# Altium project Throttle By Wire.PrjPcb
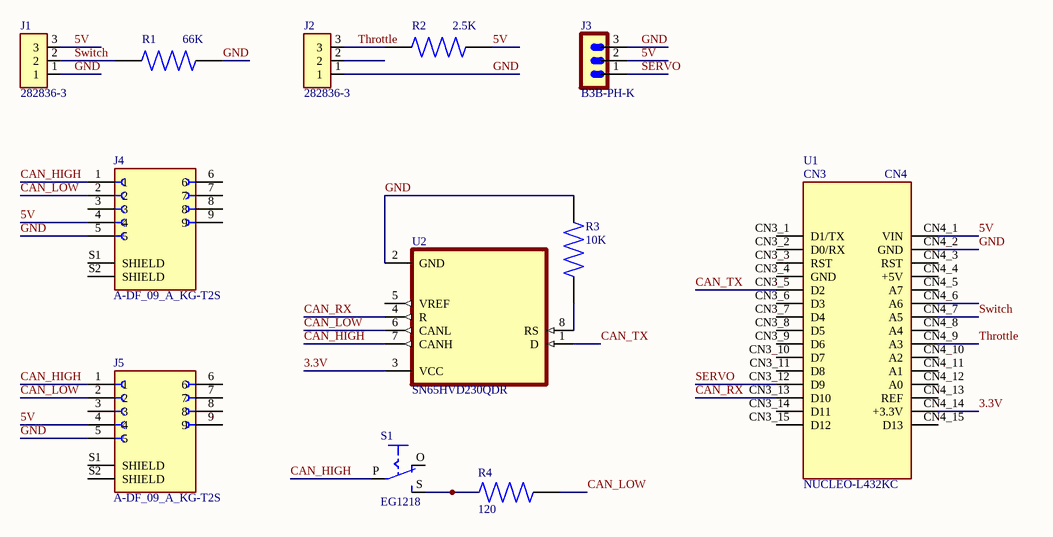
[diagram p0: Sheet1.SchDoc]
1 sheet, 12 parts. Net scope: global (net labels, ports and power ports of the same name join across sheets).
Board file: Throttle By Wire.PcbDoc

## Sheet Sheet1.SchDoc
size A; SheetNumber: 1; SheetTotal: 1

### Parts
J1  282836-3  [TE_282836-3]
J2  282836-3  [TE_282836-3]
J3  B3B-PH-K  [B3B-PH-K]
J4  A-DF_09_A_KG-T2S  [ASSMANN_A-DF_09_A_KG-T2S]
J5  A-DF_09_A_KG-T2S  [ASSMANN_A-DF_09_A_KG-T2S]
R1  66K  [RESC3216X65N]
R2  2.5K  [RESC3216X65N]
R3  10K  [RESC3216X65N]
R4  120  [RESC3216X65N]
S1  EG1218  [EG1218]
U1  NUCLEO-L432KC  [MODULE_NUCLEO-L432KC]
U2  SN65HVD230QDR  [SOIC127P599X175-8N]

### Nets
3.3V: U1.CN4_14(+3.3V) U2.3(VCC)
5V: J1.3 J3.2 J4.4 J5.4 R2.2 U1.CN4_1(VIN)
CAN_HIGH: J4.1 J5.1 S1.P U2.7(CANH)
CAN_LOW: J4.2 J5.2 R4.2 U2.6(CANL)
CAN_RX: U1.CN3_13(D10) U2.4(R)
CAN_TX: U1.CN3_5(D2) U2.1(D)
GND: J1.1 J2.1 J3.3 J4.5 J5.5 R1.2 R3.2 U1.CN4_2(GND) U2.2(GND)
SERVO: J3.1 U1.CN3_12(D9)
Switch: J1.2 R1.1 U1.CN4_7(A5)
Throttle: J2.3 R2.1 U1.CN4_9(A3)
NetR3_1: R3.1 U2.8(RS)
NetR4_1: R4.1 S1.S

Not connected (* = marked no-connect by the designer): J2 2; J4 3 6 7 8 9 S1(SHIELD) S2(SHIELD); J5 3 6 7 8 9 S1(SHIELD) S2(SHIELD); S1 O; U1 CN3_1(D1/TX) CN3_2(D0/RX) CN3_3(RST) CN3_4(GND) CN3_6(D3) CN3_7(D4) CN3_8(D5) CN3_9(D6) CN3_10(D7) CN3_11(D8) CN3_14(D11) CN3_15(D12) CN4_3(RST) CN4_4(+5V) CN4_5(A7) CN4_6(A6) CN4_8(A4) CN4_10(A2) CN4_11(A1) CN4_12(A0) CN4_13(REF) CN4_15(D13); U2 5(VREF)

### Notes on the sheet
- (in symbol NUCLEO-L432KC) CN3; CN4

### Library data of the parts
J1 J2 = 282836-3: TERM BLOCK 3POS SIDE ENTRY 5MM; Price: None; Value: *; Package: None; Availability: Unavailable; MP: 282836-3
J3 = B3B-PH-K: Connector Header Through Hole 3 position 0.079 (2.00mm); MF: JST; Package: None; Value: *; MP: B3B-PH-K; Price: None; SnapEDA_Link: https://www.snapeda.com/parts/B3B-PH-K/JST/view-part/2895696/?ref=snap; Check_prices: https://www.snapeda.com/parts/B3B-PH-K/JST/view-part/2895696/?ref=eda; Availability: No availability data
J4 J5 = A-DF_09_A_KG-T2S: 9 Position D-Sub Receptacle, Female Sockets Connector; MF: Assmann WSW; MP: A-DF 09 A/KG-T2S; Value: *; Purchase-URL: https://pricing.snapeda.com/search/part/A-DF 09 A/KG-T2S/?ref=eda; Package: None; Check_prices: https://www.snapeda.com/parts/A-DF%2009%20A/KG-T2S/Assmann+WSW+Components/view-part/?ref=eda; Price: None; SnapEDA_Link: https://www.snapeda.com/parts/A-DF%2009%20A/KG-T2S/Assmann+WSW+Components/view-part/?ref=snap; Availability: In Stock
R1-R4 = KTR18EZPF9530: Package: None; Price: None; Value: *; MP: KTR18EZPF9530; Availability: Unavailable
S1 = EG1218: <b>SLIDING SWITCH</b><p> 0.1" spacing through hole, vertical SPDT slide switch <p>http://www.ladyada.net/library/pcb/eaglelibrary.html</p>; Package: None; Availability: Unavailable; Value: *; MP: EG1218; Price: None
U1 = NUCLEO-L432KC: STM32 Nucleo-32 development board with STM32L432KC MCU, supports Arduino connectivity; Package: None; Price: None; Availability: Unavailable; MP: NUCLEO-L432KC; Value: *
U2 = SN65HVD230QDR: 3.3-V CAN Transceiver with Standby Mode 8-SOIC -40 to 125; MF: Texas Instruments; Package: SOIC-8 Texas Instruments; Price: None; MP: SN65HVD230QDR; Availability: Good; Value: *; Check_prices: https://www.snapeda.com/parts/SN65HVD230QDR/Texas%20Instruments/view-part/1178075/?ref=eda; Purchase-URL: https://pricing.snapeda.com/search/part/SN65HVD230QDR/?ref=eda; SnapEDA_Link: https://www.snapeda.com/parts/SN65HVD230QDR/Texas%20Instruments/view-part/1178075/?ref=snap